# Altium schematic sheet vco.SchDoc
size A4; Organization: Altium Limited; Address1: L3, 12a Rodborough Rd; Address2: Frenchs Forest; Address3: NSW; Address4: Australia 2086
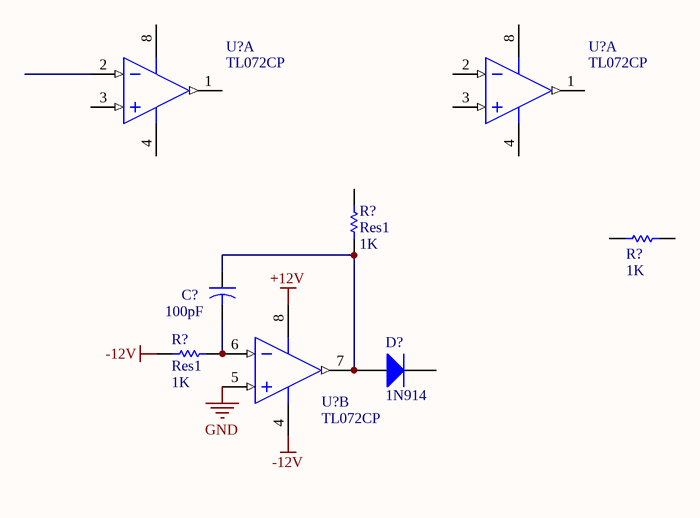
[diagram p0: vco.SchDoc]

## Parts
(Parts that share a designator on the sheet are numbered #1, #2 ... from top to bottom, then left to right.)
C?  value 100pF  [CAPR5-4X5]  (hidden comment: Cap2)
D?  1N914  [DO-35]
R?#1  Res1  value 1K  [AXIAL-0.3]
R?#2  value 1K  [AXIAL-0.3]  (hidden comment: Res1)
R?#3  Res1  value 1K  [AXIAL-0.3]
U?#1  TL072CP  [TI-P8]  (part A of 2)
U?#2  TL072CP  [TI-P8]  (part A of 2)
U?#3  TL072CP  [TI-P8]  (part B of 2)

## Nets
+12V: U?#3.8(VCC+)
-12V: R?#3.1 U?#3.4(VCC-)
GND: U?#3.5(IN2+)
NetC?_1: C?.1 D?.1(A) R?#1.1 U?#3.7(OUT2)
NetC?_2: C?.2 R?#3.2 U?#3.6(IN2-)

Not connected (* = marked no-connect by the designer): D? 2(K); R?#1 2; R?#2 1 2; U?#1 1(OUT1) 2(IN1-) 3(IN1+) 4(VCC-) 8(VCC+); U?#2 1(OUT1) 2(IN1-) 3(IN1+) 4(VCC-) 8(VCC+)

## Notes on the sheet
- Title
- Size:
- Date:
- A4
- Number:
- Time:
- Revision:
- Sheet
- of
- File:

## Library data of the parts
C? = Cap2: Capacitor; Published: 23-Sep-2002; PackageReference: CAPR5-4X5; Publisher: Altium Limited; PackageDescription: Capacitor; 2 Leads
D? = 1N914: High Conductance Fast Diode; Published: 8-Jun-2000; LatestRevisionDate: 17-Jul-2002; LatestRevisionNote: Re-released for DXP Platform.; DatasheetDocument: 1997; PackageReference: DO-35; Publisher: Altium Limited; Code_JEDEC: DO-204-AH; ComponentLink1Description: Manufacturer Link; ComponentLink1URL: http://www.fairchildsemi.com/; ComponentLink2Description: Datasheet; ComponentLink2URL: http://www.fairchildsemi.com/ds/1N%2F1N914.pdf
R?#1-R?#3 = Res1: Resistor; Published: 8-Jun-2000; LatestRevisionDate: 17-Jul-2002; LatestRevisionNote: Re-released for DXP Platform.; PackageReference: AXIAL-0.3; Publisher: Altium Limited; PackageDescription: Axial Device, Thru-Hole; 2 Leads; 0.3 in Pin Spacing
U?#1-U?#3 = TL072CP: Dual Low-Noise JFET-Input General-Purpose Operational Amplifier, 7 to 36 V, 0 to 70 degC, 8-pin DIP (P8), Pb-Free (RoHS); Manufacturer: Texas Instruments; CMRR(Min)(dB): 70; GBW(Typ)(MHz): 3; IIB(Max)(pA): 200; Iq per channel(Max)(mA): 2.5; Number of Channels: 2; Offset Drift(Typ)(uV/C): 18; Rating: Catalog; Slew Rate(Typ)(V/us): 13; Sub Family: General Purpose Amplifier, High Supply Voltage Amplifier (>=30V); Total Supply Voltage(Max)(+5V is 5, +/-5V is 10): 36; Total Supply Voltage(Min)(+5V is 5, +/-5V is 10): 7; Vio (25C)(Max)(mV): 10; DatasheetVersion: SLOS080J; PackageVersion: 4040082/E, 04/2010; PackageReference: P8; PackageDescription: 8-Pin Plastic In-Line, Body 9.59 x 6.35 mm, Pitch 2.54 mm; Supplier 1: Digi-Key; Supplier Part Number 1: 296-1775-5-ND; Supplier 2: Farnell; Supplier Part Number 2: 1106015; Supplier 3: Newark; Supplier Part Number 3: 60K6988; Supplier 4: Mouser; Supplier Part Number 4: 595-TL072CP; Eco-Plan: Pb-Free (RoHS); Vn at 1kHz(Typ)(nV/rtHz): 18; Mounting Technology: Through Hole; Code_JEDEC: MS-001; PartNumber: TL072CP; ComponentLink1Description: Manufacturer URL; ComponentLink1URL: http://www.ti.com/; ComponentLink2Description: Datasheet; ComponentLink2URL: http://www.ti.com/lit/ds/symlink/tl072.pdf; ComponentLink3Description: Package Specification; ComponentLink3URL: http://www.ti.com/litv/pdf/mpdi001b